# Altium schematic sheet Battery circuit.SchDoc
size A
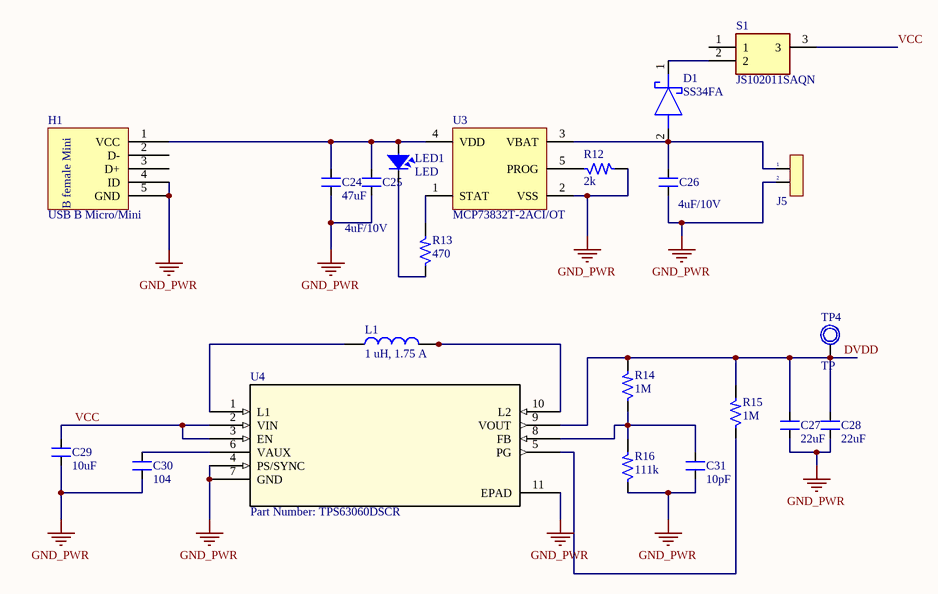
[diagram p0: Battery circuit.SchDoc]

## Parts
C24  47uF  [SM-0805]
C25  4uF/10V  [SM-0805]
C26  4uF/10V  [SM-0805]
C27  22uF  [SM-0805]
C28  22uF  [SM-0805]
C29  10uF  [SM-0805]
C30  104  [SM-0805]
C31  10pF  [SM-0805]
D1  SS34FA  [SODFL3618X143N]
H1  USB B Micro/Mini  [USB-B-MICRO-female Tai02]
J5  Jumper 2  [J2_Jst SH_1mm]  (value not drawn)
L1  1 uH, 1.75 A  [WE-TPC_2811]
LED1  LED  [SM-0805]
R12  2k  [SM-0805]
R13  470  [SM-0805]
R14  1M  [SM-0805]
R15  1M  [SM-0805]
R16  111k  [SM-0805]
S1  JS102011SAQN  [JS102011SAQN]
TP4  TP  [TP1]
U3  MCP73832T-2ACI/OT  [SOT-23-OT5_N]
U4  Part Number: TPS63060DSCR  [DSC10_1P70X2P15]

## Nets
GND_PWR: C24.1 C25.1 C26.1 C27.1 C28.1 C29.1 C30.1 C31.1 H1.4(ID) H1.5(GND) J5.2 R12.2 R16.1 U3.2(VSS) U4.4(PS/SYNC) U4.7(GND) U4.11(EPAD)
DVDD: C27.2 C28.2 R14.2 R15.2 TP4.1 U4.9(VOUT)
VCC: C29.2 S1.3 U4.2(VIN) U4.3(EN)
NetC24_2: C24.2 C25.2 H1.1(VCC) LED1.1 U3.4(VDD)
NetC26_2: C26.2 D1.2(A) J5.1 U3.3(VBAT)
NetC30_2: C30.2 U4.6(VAUX)
NetC31_2: C31.2 R14.1 R16.2 U4.8(FB)
NetD1_1: D1.1(K) S1.2
NetL1_1: L1.1 U4.1(L1)
NetL1_2: L1.2 U4.10(L2)
NetLED1_2: LED1.2 R13.1
NetR12_1: R12.1 U3.5(PROG)
NetR13_2: R13.2 U3.1(STAT)
NetR15_1: R15.1 U4.5(PG)

Not connected (* = marked no-connect by the designer): H1 2(D-) 3(D+); S1 1

## Notes on the sheet
- (in symbol USB B Female Micro/Mini SMD) B female Mini

## Library data of the parts
C24-C31 = CM: Cap SMD; Value: 103
D1 = SS34FA: Schottky Diode; Manufacturer_Name: ON Semiconductor; Datasheet Link: https://componentsearchengine.com/Datasheets/1/SS34FA.pdf; Height: 1.43mm; Mouser Part Number: 512-SS34FA; Mouser Price/Stock: https://www.mouser.com/Search/Refine.aspx?Keyword=512-SS34FA; Manufacturer_Part_Number: SS34FA
H1 = USB B Female Micro/Mini SMD
J5 = JP 2: Value: JP 2
L1 = 744028001: SMT Shielded Tiny Power Inductor WE-TPC, size 2811, 1 uH, 1.75 A; Rated Current: 1.75 A; Inductance: 1 uH; DC Resistance max.: 85 mOhm; Self Resonant Frequency: 150 MHz; Saturation Current: 1.5 A; ComponentLink1Description: Manufacturer; ComponentLink1URL: http://www.we-online.de; ComponentLink2Description: Datasheet; ComponentLink2URL: https://katalog.we-online.com/pbs/datasheet/744028001.pdf; Part Number: 744028001; Published Date: December 2018; Publisher: Wurth Elektronik; Size: 2811; Operating Temperature: -40 to +125 degC; Mounting Technology: SMT; Packaging: Tape and Reel
LED1 = LED: LED Single colour Green and Red; Value: LED 3 ly Single Colour
R12-R16 = R: Resistor 1/4W; Value: R1/4W - 1K
S1 = JS102011SAQN: Switch; Manufacturer_Name: C & K COMPONENTS; Allied_Number: 71173976; Datasheet Link: http://www.ckswitches.com/media/1422/js.pdf; Manufacturer_Part_Number: JS102011SAQN; Mouser Part Number: 611-JS102011SAQN; Mouser Price/Stock: https://www.mouser.com/Search/Refine.aspx?Keyword=611-JS102011SAQN; RS Part Number: 1543603; RS Price/Stock: http://uk.rs-online.com/web/p/products/1543603; Allied Price/Stock: https://www.alliedelec.com/c-k-js102011saqn/71173976/
TP4 = TP1: Test Point; Value: Test Point
U3 = MCP73832T-2ACI/OT: Miniature Single-Cell, Fully Integrated Li-Ion, Li-Polymer Charge Management Controller, 4.2V, 5-Pin SOT-23, Industrial Temperature, Tape and Reel; Published: 29-Jan-2009; LatestRevisionDate: 27-Nov-2009; LatestRevisionNote: Updated to datasheet revision E, Sep-2008; DatasheetVersion: revE, Sep-2008; PackageVersion: revBB, Aug-2009; PackageReference: SOT-23-OT5; Publisher: Altium Limited; PackageDescription: 5-Lead Plastic Small Outline Transistor (OT) [SOT-23]; Supplier 1: Digi-Key; Supplier Part Number 1: MCP73832T-2ACI/OTTR-ND; Supplier 2: Digi-Key; Supplier Part Number 2: MCP73832T-2ACI/OTCT-ND; Supplier 3: Digi-Key; Supplier Part Number 3: MCP73832T-2ACI/OTDKR-ND; Supplier 4: Farnell; Supplier Part Number 4: 1332159; Code_IPC: SOT23-5; ComponentLink1Description: Datasheet; ComponentLink1URL: http://ww1.microchip.com/downloads/en/DeviceDoc/21984e.pdf; ComponentLink2Description: Packaging Specification; ComponentLink2URL: http://www.microchip.com/stellent/groups/techpub_sg/documents/packagingspec/en012702.pdf; ComponentLink3Description: Microchip.com Home; ComponentLink3URL: http://www.microchip.com/
U4 = TPS63060DSCR: No Description Available; Vendor: Texas Instruments; Built_By: EMA_UL_Team; Manufacturer_Part_Number: TPS63060DSCR; Manufacturer: Texas Instruments; Copyright: Copyright (C) 2018 Accelerated Designs. All rights reserved; RefDes: RefDes; Type: DEV; Value: Value